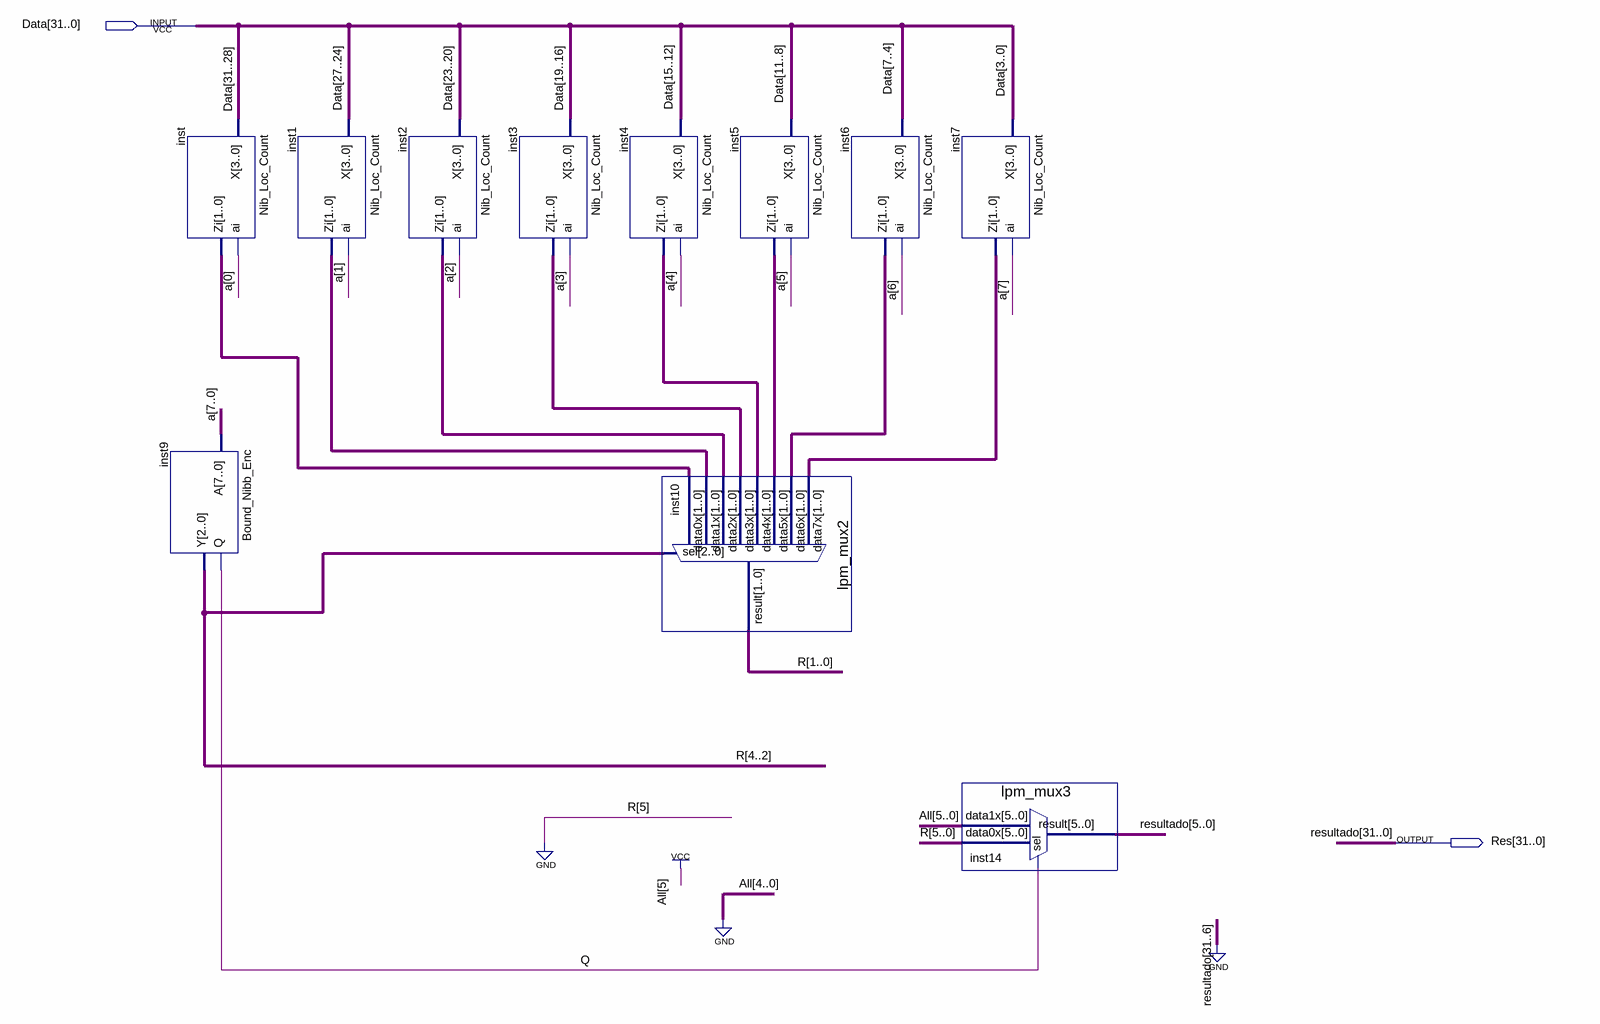
[diagram p0: schematic sheet]
// Quartus schematic CLZ.bdf as structural Verilog: 11 symbols, 2 pins
module CLZ (
  input  [31:0] Data,
  output [31:0] Res
);

  wire Q;
  wire [1:0] inst1_zi, inst2_zi, inst3_zi, inst4_zi, inst5_zi, inst6_zi, inst7_zi, inst_zi;
  wire [4:0] R;
  wire [7:0] a;

  Nib_Loc_Count inst (.X(Data[31:28]), .ai(a[0]), .Zi(inst_zi));
  Bound_Nibb_Enc inst9 (.A(a), .Q(Q), .Y(R[4:2]));
  Nib_Loc_Count inst1 (.X(Data[27:24]), .ai(a[1]), .Zi(inst1_zi));
  Nib_Loc_Count inst2 (.X(Data[23:20]), .ai(a[2]), .Zi(inst2_zi));
  Nib_Loc_Count inst3 (.X(Data[19:16]), .ai(a[3]), .Zi(inst3_zi));
  Nib_Loc_Count inst4 (.X(Data[15:12]), .ai(a[4]), .Zi(inst4_zi));
  lpm_mux2 inst10 (
    .data7x(inst7_zi), .data6x(inst6_zi), .data5x(inst5_zi), .data4x(inst4_zi), .data3x(inst3_zi),
    .data2x(inst2_zi), .data1x(inst1_zi), .data0x(inst_zi), .sel(R[4:2]), .result(R[1:0]));
  Nib_Loc_Count inst5 (.X(Data[11:8]), .ai(a[5]), .Zi(inst5_zi));
  Nib_Loc_Count inst6 (.X(Data[7:4]), .ai(a[6]), .Zi(inst6_zi));
  Nib_Loc_Count inst7 (.X(Data[3:0]), .ai(a[7]), .Zi(inst7_zi));
  lpm_mux3 inst14 (.data1x(6'b100000), .data0x({1'b0, R}), .sel(Q), .result(Res[5:0]));

  assign Res[31:6] = {26{1'b0}};

  // Other names for the same wires on the sheet: resultado[5:0] = Res[5:0]
endmodule
